# Altium schematic sheet Sheet1.SchDoc
size A3
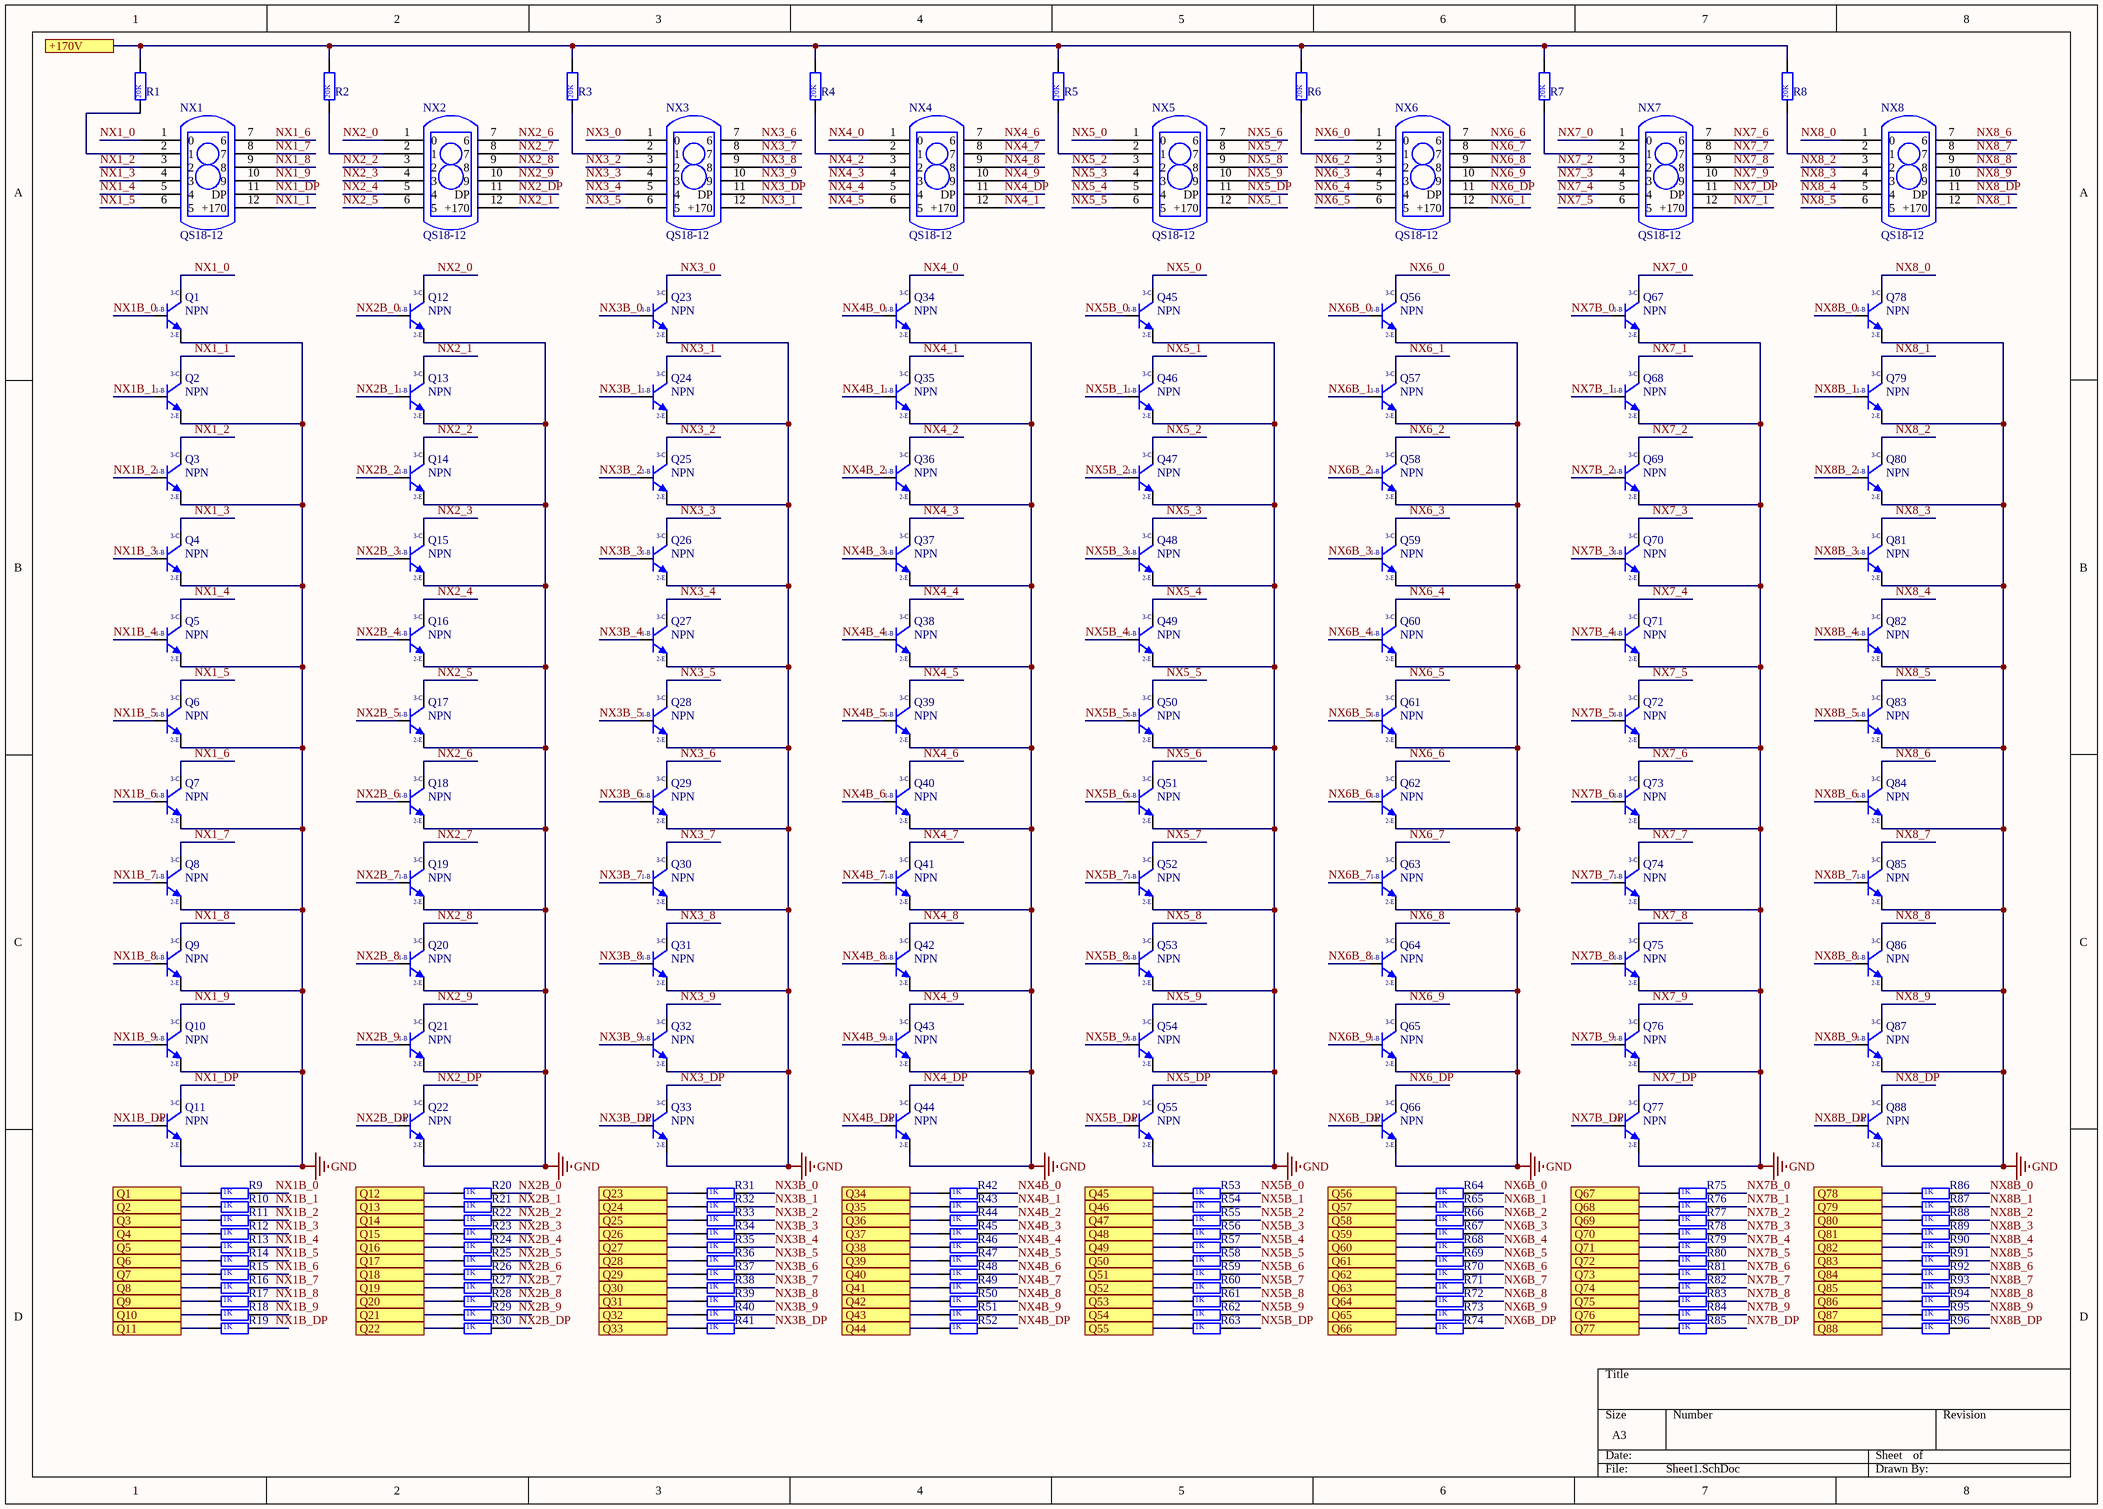
[diagram p0: Sheet1.SchDoc]

## Parts
NX1  QS18-12  [PCBComponent_1]
NX2  QS18-12  [PCBComponent_1]
NX3  QS18-12  [PCBComponent_1]
NX4  QS18-12  [PCBComponent_1]
NX5  QS18-12  [PCBComponent_1]
NX6  QS18-12  [PCBComponent_1]
NX7  QS18-12  [PCBComponent_1]
NX8  QS18-12  [PCBComponent_1]
Q1  NPN  [SOT-23]
Q2  NPN  [SOT-23]
Q3  NPN  [SOT-23]
Q4  NPN  [SOT-23]
Q5  NPN  [SOT-23]
Q6  NPN  [SOT-23]
Q7  NPN  [SOT-23]
Q8  NPN  [SOT-23]
Q9  NPN  [SOT-23]
Q10  NPN  [SOT-23]
Q11  NPN  [SOT-23]
Q12  NPN  [SOT-23]
Q13  NPN  [SOT-23]
Q14  NPN  [SOT-23]
Q15  NPN  [SOT-23]
Q16  NPN  [SOT-23]
Q17  NPN  [SOT-23]
Q18  NPN  [SOT-23]
Q19  NPN  [SOT-23]
Q20  NPN  [SOT-23]
Q21  NPN  [SOT-23]
Q22  NPN  [SOT-23]
Q23  NPN  [SOT-23]
Q24  NPN  [SOT-23]
Q25  NPN  [SOT-23]
Q26  NPN  [SOT-23]
Q27  NPN  [SOT-23]
Q28  NPN  [SOT-23]
Q29  NPN  [SOT-23]
Q30  NPN  [SOT-23]
Q31  NPN  [SOT-23]
Q32  NPN  [SOT-23]
Q33  NPN  [SOT-23]
Q34  NPN  [SOT-23]
Q35  NPN  [SOT-23]
Q36  NPN  [SOT-23]
Q37  NPN  [SOT-23]
Q38  NPN  [SOT-23]
Q39  NPN  [SOT-23]
Q40  NPN  [SOT-23]
Q41  NPN  [SOT-23]
Q42  NPN  [SOT-23]
Q43  NPN  [SOT-23]
Q44  NPN  [SOT-23]
Q45  NPN  [SOT-23]
Q46  NPN  [SOT-23]
Q47  NPN  [SOT-23]
Q48  NPN  [SOT-23]
Q49  NPN  [SOT-23]
Q50  NPN  [SOT-23]
Q51  NPN  [SOT-23]
Q52  NPN  [SOT-23]
Q53  NPN  [SOT-23]
Q54  NPN  [SOT-23]
Q55  NPN  [SOT-23]
Q56  NPN  [SOT-23]
Q57  NPN  [SOT-23]
Q58  NPN  [SOT-23]
Q59  NPN  [SOT-23]
Q60  NPN  [SOT-23]
Q61  NPN  [SOT-23]
Q62  NPN  [SOT-23]
Q63  NPN  [SOT-23]
Q64  NPN  [SOT-23]
Q65  NPN  [SOT-23]
Q66  NPN  [SOT-23]
Q67  NPN  [SOT-23]
Q68  NPN  [SOT-23]
Q69  NPN  [SOT-23]
Q70  NPN  [SOT-23]
Q71  NPN  [SOT-23]
Q72  NPN  [SOT-23]
Q73  NPN  [SOT-23]
Q74  NPN  [SOT-23]
Q75  NPN  [SOT-23]
Q76  NPN  [SOT-23]
Q77  NPN  [SOT-23]
Q78  NPN  [SOT-23]
Q79  NPN  [SOT-23]
Q80  NPN  [SOT-23]
Q81  NPN  [SOT-23]
Q82  NPN  [SOT-23]
Q83  NPN  [SOT-23]
Q84  NPN  [SOT-23]
Q85  NPN  [SOT-23]
Q86  NPN  [SOT-23]
Q87  NPN  [SOT-23]
Q88  NPN  [SOT-23]
R1  value 20K  [0805]  (hidden comment: R)
R2  value 20K  [0805]  (hidden comment: R)
R3  value 20K  [0805]  (hidden comment: R)
R4  value 20K  [0805]  (hidden comment: R)
R5  value 20K  [0805]  (hidden comment: R)
R6  value 20K  [0805]  (hidden comment: R)
R7  value 20K  [0805]  (hidden comment: R)
R8  value 20K  [0805]  (hidden comment: R)
R9  value 1K  [0805]  (hidden comment: R)
R10  value 1K  [0805]  (hidden comment: R)
R11  value 1K  [0805]  (hidden comment: R)
R12  value 1K  [0805]  (hidden comment: R)
R13  value 1K  [0805]  (hidden comment: R)
R14  value 1K  [0805]  (hidden comment: R)
R15  value 1K  [0805]  (hidden comment: R)
R16  value 1K  [0805]  (hidden comment: R)
R17  value 1K  [0805]  (hidden comment: R)
R18  value 1K  [0805]  (hidden comment: R)
R19  value 1K  [0805]  (hidden comment: R)
R20  value 1K  [0805]  (hidden comment: R)
R21  value 1K  [0805]  (hidden comment: R)
R22  value 1K  [0805]  (hidden comment: R)
R23  value 1K  [0805]  (hidden comment: R)
R24  value 1K  [0805]  (hidden comment: R)
R25  value 1K  [0805]  (hidden comment: R)
R26  value 1K  [0805]  (hidden comment: R)
R27  value 1K  [0805]  (hidden comment: R)
R28  value 1K  [0805]  (hidden comment: R)
R29  value 1K  [0805]  (hidden comment: R)
R30  value 1K  [0805]  (hidden comment: R)
R31  value 1K  [0805]  (hidden comment: R)
R32  value 1K  [0805]  (hidden comment: R)
R33  value 1K  [0805]  (hidden comment: R)
R34  value 1K  [0805]  (hidden comment: R)
R35  value 1K  [0805]  (hidden comment: R)
R36  value 1K  [0805]  (hidden comment: R)
R37  value 1K  [0805]  (hidden comment: R)
R38  value 1K  [0805]  (hidden comment: R)
R39  value 1K  [0805]  (hidden comment: R)
R40  value 1K  [0805]  (hidden comment: R)
R41  value 1K  [0805]  (hidden comment: R)
R42  value 1K  [0805]  (hidden comment: R)
R43  value 1K  [0805]  (hidden comment: R)
R44  value 1K  [0805]  (hidden comment: R)
R45  value 1K  [0805]  (hidden comment: R)
R46  value 1K  [0805]  (hidden comment: R)
R47  value 1K  [0805]  (hidden comment: R)
R48  value 1K  [0805]  (hidden comment: R)
R49  value 1K  [0805]  (hidden comment: R)
R50  value 1K  [0805]  (hidden comment: R)
R51  value 1K  [0805]  (hidden comment: R)
R52  value 1K  [0805]  (hidden comment: R)
R53  value 1K  [0805]  (hidden comment: R)
R54  value 1K  [0805]  (hidden comment: R)
R55  value 1K  [0805]  (hidden comment: R)
R56  value 1K  [0805]  (hidden comment: R)
R57  value 1K  [0805]  (hidden comment: R)
R58  value 1K  [0805]  (hidden comment: R)
R59  value 1K  [0805]  (hidden comment: R)
R60  value 1K  [0805]  (hidden comment: R)
R61  value 1K  [0805]  (hidden comment: R)
R62  value 1K  [0805]  (hidden comment: R)
R63  value 1K  [0805]  (hidden comment: R)
R64  value 1K  [0805]  (hidden comment: R)
R65  value 1K  [0805]  (hidden comment: R)
R66  value 1K  [0805]  (hidden comment: R)
R67  value 1K  [0805]  (hidden comment: R)
R68  value 1K  [0805]  (hidden comment: R)
R69  value 1K  [0805]  (hidden comment: R)
R70  value 1K  [0805]  (hidden comment: R)
R71  value 1K  [0805]  (hidden comment: R)
R72  value 1K  [0805]  (hidden comment: R)
R73  value 1K  [0805]  (hidden comment: R)
R74  value 1K  [0805]  (hidden comment: R)
R75  value 1K  [0805]  (hidden comment: R)
R76  value 1K  [0805]  (hidden comment: R)
R77  value 1K  [0805]  (hidden comment: R)
R78  value 1K  [0805]  (hidden comment: R)
R79  value 1K  [0805]  (hidden comment: R)
R80  value 1K  [0805]  (hidden comment: R)
R81  value 1K  [0805]  (hidden comment: R)
R82  value 1K  [0805]  (hidden comment: R)
R83  value 1K  [0805]  (hidden comment: R)
R84  value 1K  [0805]  (hidden comment: R)
R85  value 1K  [0805]  (hidden comment: R)
R86  value 1K  [0805]  (hidden comment: R)
R87  value 1K  [0805]  (hidden comment: R)
R88  value 1K  [0805]  (hidden comment: R)
R89  value 1K  [0805]  (hidden comment: R)
R90  value 1K  [0805]  (hidden comment: R)
R91  value 1K  [0805]  (hidden comment: R)
R92  value 1K  [0805]  (hidden comment: R)
R93  value 1K  [0805]  (hidden comment: R)
R94  value 1K  [0805]  (hidden comment: R)
R95  value 1K  [0805]  (hidden comment: R)
R96  value 1K  [0805]  (hidden comment: R)

## Ports
+170V, Q1, Q2, Q3, Q4, Q5, Q6, Q7, Q8, Q9, Q10, Q11, Q12, Q13, Q14, Q15, Q16, Q17, Q18, Q19, Q20, Q21, Q22, Q23, Q24, Q25, Q26, Q27, Q28, Q29, Q30, Q31, Q32, Q33, Q34, Q35, Q36, Q37, Q38, Q39, Q40, Q41, Q42, Q43, Q44, Q45, Q46, Q47, Q48, Q49, Q50, Q51, Q52, Q53, Q54, Q55, Q56, Q57, Q58, Q59, Q60, Q61, Q62, Q63, Q64, Q65, Q66, Q67, Q68, Q69, Q70, Q71, Q72, Q73, Q74, Q75, Q76, Q77, Q78, Q79, Q80, Q81, Q82, Q83, Q84, Q85, Q86, Q87, Q88

## Nets
GND: Q1.2(E) Q2.2(E) Q3.2(E) Q4.2(E) Q5.2(E) Q6.2(E) Q7.2(E) Q8.2(E) Q9.2(E) Q10.2(E) Q11.2(E) Q12.2(E) Q13.2(E) Q14.2(E) Q15.2(E) Q16.2(E) Q17.2(E) Q18.2(E) Q19.2(E) Q20.2(E) Q21.2(E) Q22.2(E) Q23.2(E) Q24.2(E) Q25.2(E) Q26.2(E) Q27.2(E) Q28.2(E) Q29.2(E) Q30.2(E) Q31.2(E) Q32.2(E) Q33.2(E) Q34.2(E) Q35.2(E) Q36.2(E) Q37.2(E) Q38.2(E) Q39.2(E) Q40.2(E) Q41.2(E) Q42.2(E) Q43.2(E) Q44.2(E) Q45.2(E) Q46.2(E) Q47.2(E) Q48.2(E) Q49.2(E) Q50.2(E) Q51.2(E) Q52.2(E) Q53.2(E) Q54.2(E) Q55.2(E) Q56.2(E) Q57.2(E) Q58.2(E) Q59.2(E) Q60.2(E) Q61.2(E) Q62.2(E) Q63.2(E) Q64.2(E) Q65.2(E) Q66.2(E) Q67.2(E) Q68.2(E) Q69.2(E) Q70.2(E) Q71.2(E) Q72.2(E) Q73.2(E) Q74.2(E) Q75.2(E) Q76.2(E) Q77.2(E) Q78.2(E) Q79.2(E) Q80.2(E) Q81.2(E) Q82.2(E) Q83.2(E) Q84.2(E) Q85.2(E) Q86.2(E) Q87.2(E) Q88.2(E)
+170V: R1.2 R2.2 R3.2 R4.2 R5.2 R6.2 R7.2 R8.2 ; port +170V
NX1_0: NX1.1(0) Q1.3(C)
NX1_1: NX1.12(+170) Q2.3(C)
NX1_2: NX1.3(2) Q3.3(C)
NX1_3: NX1.4(3) Q4.3(C)
NX1_4: NX1.5(4) Q5.3(C)
NX1_5: NX1.6(5) Q6.3(C)
NX1_6: NX1.7(6) Q7.3(C)
NX1_7: NX1.8(7) Q8.3(C)
NX1_8: NX1.9(8) Q9.3(C)
NX1_9: NX1.10(9) Q10.3(C)
NX1_DP: NX1.11(DP) Q11.3(C)
NX1B_0: Q1.1(B) R9.2
NX1B_1: Q2.1(B) R10.2
NX1B_2: Q3.1(B) R11.2
NX1B_3: Q4.1(B) R12.2
NX1B_4: Q5.1(B) R13.2
NX1B_5: Q6.1(B) R14.2
NX1B_6: Q7.1(B) R15.2
NX1B_7: Q8.1(B) R16.2
NX1B_8: Q9.1(B) R17.2
NX1B_9: Q10.1(B) R18.2
NX1B_DP: Q11.1(B) R19.2
NX2_0: NX2.1(0) Q12.3(C)
NX2_1: NX2.12(+170) Q13.3(C)
NX2_2: NX2.3(2) Q14.3(C)
NX2_3: NX2.4(3) Q15.3(C)
NX2_4: NX2.5(4) Q16.3(C)
NX2_5: NX2.6(5) Q17.3(C)
NX2_6: NX2.7(6) Q18.3(C)
NX2_7: NX2.8(7) Q19.3(C)
NX2_8: NX2.9(8) Q20.3(C)
NX2_9: NX2.10(9) Q21.3(C)
NX2_DP: NX2.11(DP) Q22.3(C)
NX2B_0: Q12.1(B) R20.2
NX2B_1: Q13.1(B) R21.2
NX2B_2: Q14.1(B) R22.2
NX2B_3: Q15.1(B) R23.2
NX2B_4: Q16.1(B) R24.2
NX2B_5: Q17.1(B) R25.2
NX2B_6: Q18.1(B) R26.2
NX2B_7: Q19.1(B) R27.2
NX2B_8: Q20.1(B) R28.2
NX2B_9: Q21.1(B) R29.2
NX2B_DP: Q22.1(B) R30.2
NX3_0: NX3.1(0) Q23.3(C)
NX3_1: NX3.12(+170) Q24.3(C)
NX3_2: NX3.3(2) Q25.3(C)
NX3_3: NX3.4(3) Q26.3(C)
NX3_4: NX3.5(4) Q27.3(C)
NX3_5: NX3.6(5) Q28.3(C)
NX3_6: NX3.7(6) Q29.3(C)
NX3_7: NX3.8(7) Q30.3(C)
NX3_8: NX3.9(8) Q31.3(C)
NX3_9: NX3.10(9) Q32.3(C)
NX3_DP: NX3.11(DP) Q33.3(C)
NX3B_0: Q23.1(B) R31.2
NX3B_1: Q24.1(B) R32.2
NX3B_2: Q25.1(B) R33.2
NX3B_3: Q26.1(B) R34.2
NX3B_4: Q27.1(B) R35.2
NX3B_5: Q28.1(B) R36.2
NX3B_6: Q29.1(B) R37.2
NX3B_7: Q30.1(B) R38.2
NX3B_8: Q31.1(B) R39.2
NX3B_9: Q32.1(B) R40.2
NX3B_DP: Q33.1(B) R41.2
NX4_0: NX4.1(0) Q34.3(C)
NX4_1: NX4.12(+170) Q35.3(C)
NX4_2: NX4.3(2) Q36.3(C)
NX4_3: NX4.4(3) Q37.3(C)
NX4_4: NX4.5(4) Q38.3(C)
NX4_5: NX4.6(5) Q39.3(C)
NX4_6: NX4.7(6) Q40.3(C)
NX4_7: NX4.8(7) Q41.3(C)
NX4_8: NX4.9(8) Q42.3(C)
NX4_9: NX4.10(9) Q43.3(C)
NX4_DP: NX4.11(DP) Q44.3(C)
NX4B_0: Q34.1(B) R42.2
NX4B_1: Q35.1(B) R43.2
NX4B_2: Q36.1(B) R44.2
NX4B_3: Q37.1(B) R45.2
NX4B_4: Q38.1(B) R46.2
NX4B_5: Q39.1(B) R47.2
NX4B_6: Q40.1(B) R48.2
NX4B_7: Q41.1(B) R49.2
NX4B_8: Q42.1(B) R50.2
NX4B_9: Q43.1(B) R51.2
NX4B_DP: Q44.1(B) R52.2
NX5_0: NX5.1(0) Q45.3(C)
NX5_1: NX5.12(+170) Q46.3(C)
NX5_2: NX5.3(2) Q47.3(C)
NX5_3: NX5.4(3) Q48.3(C)
NX5_4: NX5.5(4) Q49.3(C)
NX5_5: NX5.6(5) Q50.3(C)
NX5_6: NX5.7(6) Q51.3(C)
NX5_7: NX5.8(7) Q52.3(C)
NX5_8: NX5.9(8) Q53.3(C)
NX5_9: NX5.10(9) Q54.3(C)
NX5_DP: NX5.11(DP) Q55.3(C)
NX5B_0: Q45.1(B) R53.2
NX5B_1: Q46.1(B) R54.2
NX5B_2: Q47.1(B) R55.2
NX5B_3: Q48.1(B) R56.2
NX5B_4: Q49.1(B) R57.2
NX5B_5: Q50.1(B) R58.2
NX5B_6: Q51.1(B) R59.2
NX5B_7: Q52.1(B) R60.2
NX5B_8: Q53.1(B) R61.2
NX5B_9: Q54.1(B) R62.2
NX5B_DP: Q55.1(B) R63.2
NX6_0: NX6.1(0) Q56.3(C)
NX6_1: NX6.12(+170) Q57.3(C)
NX6_2: NX6.3(2) Q58.3(C)
NX6_3: NX6.4(3) Q59.3(C)
NX6_4: NX6.5(4) Q60.3(C)
NX6_5: NX6.6(5) Q61.3(C)
NX6_6: NX6.7(6) Q62.3(C)
NX6_7: NX6.8(7) Q63.3(C)
NX6_8: NX6.9(8) Q64.3(C)
NX6_9: NX6.10(9) Q65.3(C)
NX6_DP: NX6.11(DP) Q66.3(C)
NX6B_0: Q56.1(B) R64.2
NX6B_1: Q57.1(B) R65.2
NX6B_2: Q58.1(B) R66.2
NX6B_3: Q59.1(B) R67.2
NX6B_4: Q60.1(B) R68.2
NX6B_5: Q61.1(B) R69.2
NX6B_6: Q62.1(B) R70.2
NX6B_7: Q63.1(B) R71.2
NX6B_8: Q64.1(B) R72.2
NX6B_9: Q65.1(B) R73.2
NX6B_DP: Q66.1(B) R74.2
NX7_0: NX7.1(0) Q67.3(C)
NX7_1: NX7.12(+170) Q68.3(C)
NX7_2: NX7.3(2) Q69.3(C)
NX7_3: NX7.4(3) Q70.3(C)
NX7_4: NX7.5(4) Q71.3(C)
NX7_5: NX7.6(5) Q72.3(C)
NX7_6: NX7.7(6) Q73.3(C)
NX7_7: NX7.8(7) Q74.3(C)
NX7_8: NX7.9(8) Q75.3(C)
NX7_9: NX7.10(9) Q76.3(C)
NX7_DP: NX7.11(DP) Q77.3(C)
NX7B_0: Q67.1(B) R75.2
NX7B_1: Q68.1(B) R76.2
NX7B_2: Q69.1(B) R77.2
NX7B_3: Q70.1(B) R78.2
NX7B_4: Q71.1(B) R79.2
NX7B_5: Q72.1(B) R80.2
NX7B_6: Q73.1(B) R81.2
NX7B_7: Q74.1(B) R82.2
NX7B_8: Q75.1(B) R83.2
NX7B_9: Q76.1(B) R84.2
NX7B_DP: Q77.1(B) R85.2
NX8_0: NX8.1(0) Q78.3(C)
NX8_1: NX8.12(+170) Q79.3(C)
NX8_2: NX8.3(2) Q80.3(C)
NX8_3: NX8.4(3) Q81.3(C)
NX8_4: NX8.5(4) Q82.3(C)
NX8_5: NX8.6(5) Q83.3(C)
NX8_6: NX8.7(6) Q84.3(C)
NX8_7: NX8.8(7) Q85.3(C)
NX8_8: NX8.9(8) Q86.3(C)
NX8_9: NX8.10(9) Q87.3(C)
NX8_DP: NX8.11(DP) Q88.3(C)
NX8B_0: Q78.1(B) R86.2
NX8B_1: Q79.1(B) R87.2
NX8B_2: Q80.1(B) R88.2
NX8B_3: Q81.1(B) R89.2
NX8B_4: Q82.1(B) R90.2
NX8B_5: Q83.1(B) R91.2
NX8B_6: Q84.1(B) R92.2
NX8B_7: Q85.1(B) R93.2
NX8B_8: Q86.1(B) R94.2
NX8B_9: Q87.1(B) R95.2
NX8B_DP: Q88.1(B) R96.2
Q1: R9.1 ; port Q1
Q2: R10.1 ; port Q2
Q3: R11.1 ; port Q3
Q4: R12.1 ; port Q4
Q5: R13.1 ; port Q5
Q6: R14.1 ; port Q6
Q7: R15.1 ; port Q7
Q8: R16.1 ; port Q8
Q9: R17.1 ; port Q9
Q10: R18.1 ; port Q10
Q11: R19.1 ; port Q11
Q12: R20.1 ; port Q12
Q13: R21.1 ; port Q13
Q14: R22.1 ; port Q14
Q15: R23.1 ; port Q15
Q16: R24.1 ; port Q16
Q17: R25.1 ; port Q17
Q18: R26.1 ; port Q18
Q19: R27.1 ; port Q19
Q20: R28.1 ; port Q20
Q21: R29.1 ; port Q21
Q22: R30.1 ; port Q22
Q23: R31.1 ; port Q23
Q24: R32.1 ; port Q24
Q25: R33.1 ; port Q25
Q26: R34.1 ; port Q26
Q27: R35.1 ; port Q27
Q28: R36.1 ; port Q28
Q29: R37.1 ; port Q29
Q30: R38.1 ; port Q30
Q31: R39.1 ; port Q31
Q32: R40.1 ; port Q32
Q33: R41.1 ; port Q33
Q34: R42.1 ; port Q34
Q35: R43.1 ; port Q35
Q36: R44.1 ; port Q36
Q37: R45.1 ; port Q37
Q38: R46.1 ; port Q38
Q39: R47.1 ; port Q39
Q40: R48.1 ; port Q40
Q41: R49.1 ; port Q41
Q42: R50.1 ; port Q42
Q43: R51.1 ; port Q43
Q44: R52.1 ; port Q44
Q45: R53.1 ; port Q45
Q46: R54.1 ; port Q46
Q47: R55.1 ; port Q47
Q48: R56.1 ; port Q48
Q49: R57.1 ; port Q49
Q50: R58.1 ; port Q50
Q51: R59.1 ; port Q51
Q52: R60.1 ; port Q52
Q53: R61.1 ; port Q53
Q54: R62.1 ; port Q54
Q55: R63.1 ; port Q55
Q56: R64.1 ; port Q56
Q57: R65.1 ; port Q57
Q58: R66.1 ; port Q58
Q59: R67.1 ; port Q59
Q60: R68.1 ; port Q60
Q61: R69.1 ; port Q61
Q62: R70.1 ; port Q62
Q63: R71.1 ; port Q63
Q64: R72.1 ; port Q64
Q65: R73.1 ; port Q65
Q66: R74.1 ; port Q66
Q67: R75.1 ; port Q67
Q68: R76.1 ; port Q68
Q69: R77.1 ; port Q69
Q70: R78.1 ; port Q70
Q71: R79.1 ; port Q71
Q72: R80.1 ; port Q72
Q73: R81.1 ; port Q73
Q74: R82.1 ; port Q74
Q75: R83.1 ; port Q75
Q76: R84.1 ; port Q76
Q77: R85.1 ; port Q77
Q78: R86.1 ; port Q78
Q79: R87.1 ; port Q79
Q80: R88.1 ; port Q80
Q81: R89.1 ; port Q81
Q82: R90.1 ; port Q82
Q83: R91.1 ; port Q83
Q84: R92.1 ; port Q84
Q85: R93.1 ; port Q85
Q86: R94.1 ; port Q86
Q87: R95.1 ; port Q87
Q88: R96.1 ; port Q88
NetNX1_2: NX1.2(1) R1.1
NetNX2_2: NX2.2(1) R2.1
NetNX3_2: NX3.2(1) R3.1
NetNX4_2: NX4.2(1) R4.1
NetNX5_2: NX5.2(1) R5.1
NetNX6_2: NX6.2(1) R6.1
NetNX7_2: NX7.2(1) R7.1
NetNX8_2: NX8.2(1) R8.1

## Notes on the sheet
- (in symbol NPN-S8050-SOT-23) 3-C; 1-B; 2-E

## Library data of the parts
Q1-Q88 = NPN-S8050-SOT-23